# EAGLE schematic HGS_Reflector (EAGLE 9.6.1)
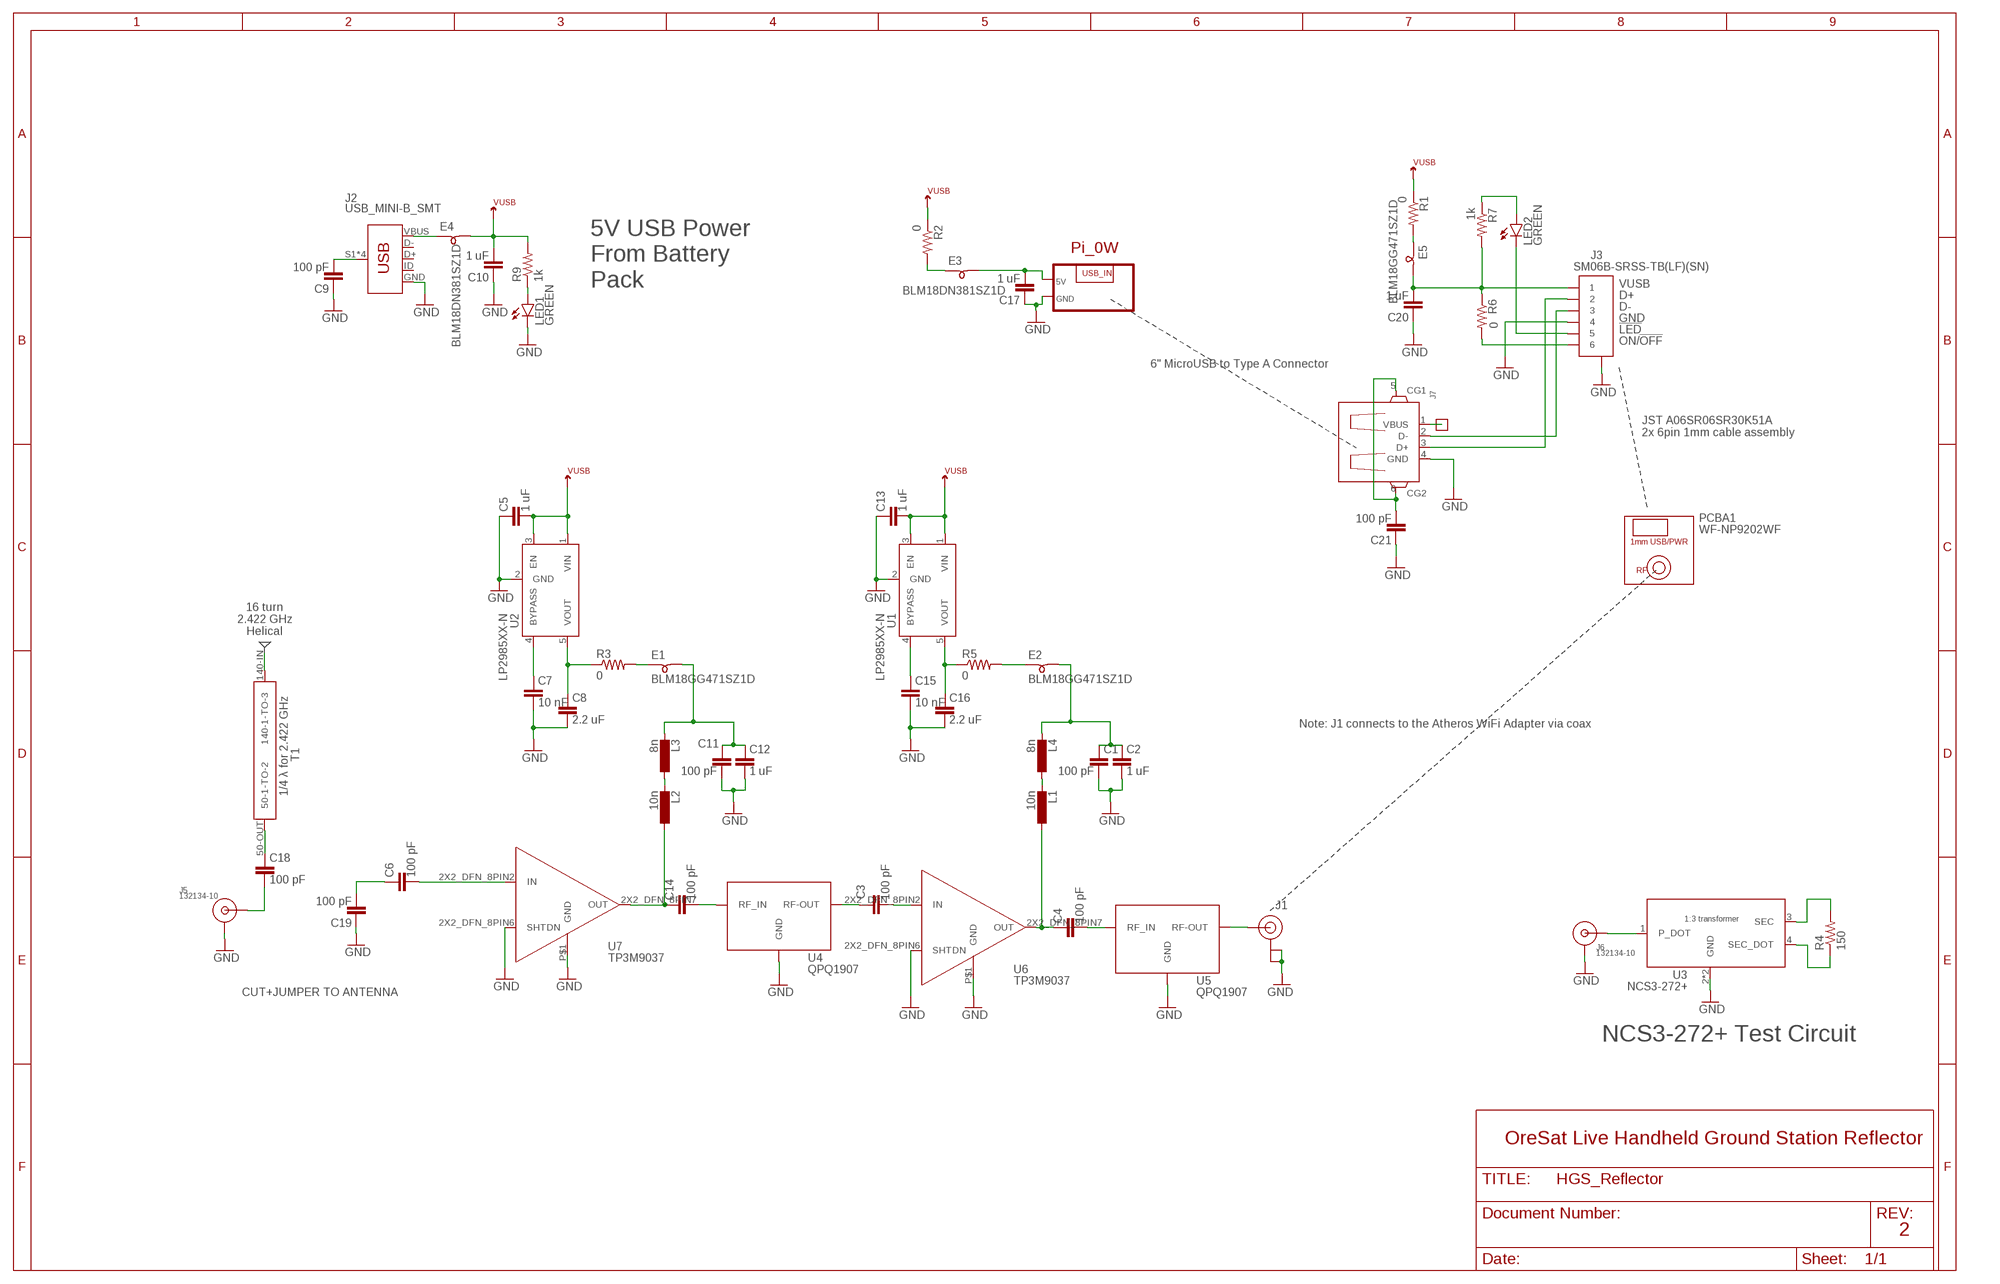
[diagram p0: schematic, sheet 1]

## Parts
C1  100 pF  C-EU0603-C-NOSILK  [.0603-C-NOSILK]
C2  1 uF  C-EU0603-C-NOSILK  [.0603-C-NOSILK]
C3  100 pF  C-EU0402-C-NOSILK  [.0402-C-NOSILK]
C4  100 pF  C-EU0402-C-NOSILK  [.0402-C-NOSILK]
C5  1 uF  C-EU0603-B-NOSILK  [.0603-B-NOSILK]
C6  100 pF  C-EU0402-C-NOSILK  [.0402-C-NOSILK]
C7  10 nF  C-EU0603-B-NOSILK  [.0603-B-NOSILK]
C8  2.2 uF  C-EU0603-B-NOSILK  [.0603-B-NOSILK]
C9  100 pF  C-EU0603-C-NOSILK  [.0603-C-NOSILK]
C10  1 uF  C-EU0603-B-NOSILK  [.0603-B-NOSILK]
C11  100 pF  C-EU0603-C-NOSILK  [.0603-C-NOSILK]
C12  1 uF  C-EU0603-C-NOSILK  [.0603-C-NOSILK]
C13  1 uF  C-EU0603-B-NOSILK  [.0603-B-NOSILK]
C14  100 pF  C-EU0402-C-NOSILK  [.0402-C-NOSILK]
C15  10 nF  C-EU0603-B-NOSILK  [.0603-B-NOSILK]
C16  2.2 uF  C-EU0603-B-NOSILK  [.0603-B-NOSILK]
C17  1 uF  C-EU0603-B-NOSILK  [.0603-B-NOSILK]
C18  100 pF  C-EU0402-C-NOSILK  [.0402-C-NOSILK]
C19  100 pF  C-EU0402-C-NOSILK  [.0402-C-NOSILK]
C20  1 uF  C-EU0603-B-NOSILK  [.0603-B-NOSILK]
C21  100 pF  C-EU0603-C-NOSILK  [.0603-C-NOSILK]
E1  BLM18GG471SZ1D  L-BEAD-0603-B  [.0603-B]
E2  BLM18GG471SZ1D  L-BEAD-0603-B  [.0603-B]
E3  BLM18DN381SZ1D  L-BEAD-0603-B  [.0603-B]
E4  BLM18DN381SZ1D  L-BEAD-0603-B  [.0603-B]
E5  BLM18GG471SZ1D  L-BEAD-0603-B  [.0603-B]
J1  U.FL  [U.FL]
J2  USB_MINI-B_SMT  [USB-MINIB]
J3  SM06B-SRSS-TB(LF)(SN)  [CONN_SM06B-SRSS-TB_JST]
J5  132134-10  [132134-10]
J6  132134-10  [132134-10]
J7  USB_HOST_W/CHASSIS_GND  [GHI2_USB_HOST_HORIZONTAL_W/CHASSIS_GND]
L1  10n  L-EUL3216C  [L3216C]
L2  10n  L-EUL3216C  [L3216C]
L3  8n  L-EUL3216C  [L3216C]
L4  8n  L-EUL3216C  [L3216C]
LED1  GREEN  LED-GREEN0603  [LED-0603]
LED2  GREEN  LED-GREEN0603  [LED-0603]
PCBA1  WF-NP9202WF  [WF-NP9202]
PCBA2  RASP_PI_0WPI_0W  [RASP_PI_0W]
R1  0  R-US_0603-B-NOSILK  [.0603-B-NOSILK]
R2  0  R-US_0603-B-NOSILK  [.0603-B-NOSILK]
R3  0  R-US_0603-B-NOSILK  [.0603-B-NOSILK]
R4  150  R-US_0402-C-NOSILK  [.0402-C-NOSILK]
R5  0  R-US_0603-B-NOSILK  [.0603-B-NOSILK]
R6  0  R-US_0603-B-NOSILK  [.0603-B-NOSILK]
R7  1k  R-US_0603-B-NOSILK  [.0603-B-NOSILK]
R9  1k  R-US_0603-B-NOSILK  [.0603-B-NOSILK]
T1  QWT2.4222  [QWT_2.422G-V2]
TP2  TEST-POINT-LARGE-SQUARE  [1X01]
U1  LP2985XX-N  [SOT-23]
U2  LP2985XX-N  [SOT-23]
U3  NCS3-272+  [GE0805C-1]
U4  QPQ1907  [QPQ1907]
U5  QPQ1907  [QPQ1907]
U6  LNA-TP3M9037  [TP3M9037]
U7  LNA-TP3M9037  [TP3M9037]

## Nets
GND: C1.2 C2.2 C5.1 C7.2 C8.2 C9.1 C10.1 C11.2 C12.2 C13.1 C15.2 C16.2 C17.1 C19.1 C20.1 C21.1 J1.1(GND) J1.2(GND) J2.GND J3.4 J3.7 J3.8 J5.SHIELD(GND) J6.SHIELD(GND) J7.4(GND) LED1.C PCBA2.GND U1.2(GND) U2.2(GND) U3.2(GND) U3.5(GND) U4.GND U4.GND2(GND) U4.GND3(GND) U5.GND U5.GND2(GND) U5.GND3(GND) U6.2X2_DFN_8PIN6(SHTDN) U6.P$1(GND) U7.2X2_DFN_8PIN6(SHTDN) U7.P$1(GND)
HELICAL: T1.140-IN(140-1-TO-3)
N$1: C7.1 U2.4(BYPASS)
N$2: E1.1 R3.2
N$3 [RF]: C4.2 U5.INPUT(RF_IN)
N$4 [RF]: C3.1 U4.OUTPUT(RF-OUT)
N$5 [RF]: J1.FEED(SIGNAL) U5.OUTPUT(RF-OUT)
N$6 [RF]: C14.2 U4.INPUT(RF_IN)
N$7: L2.2 L3.1
N$8 [RF]: C3.2 U6.2X2_DFN_8PIN2(IN)
N$9: E2.1 R5.2
N$10: LED1.A R9.1
N$11 [RF]: C6.2 U7.2X2_DFN_8PIN2(IN)
N$12: C9.2 J2.S1(SHIELD) J2.S2(SHIELD) J2.S3(SHIELD) J2.S4(SHIELD)
N$13 [RF]: C4.1 L1.1 U6.2X2_DFN_8PIN7(OUT)
N$14: L1.2 L4.1
N$15: C17.2 E3.2 PCBA2.5V
N$16 [RF]: C14.1 L2.1 U7.2X2_DFN_8PIN7(OUT)
N$17: E4.1 J2.VBUS
N$18: E3.1 R2.2
N$19: C15.1 U1.4(BYPASS)
N$20 [power]: C11.1 C12.1 E1.2 L3.2
N$21 [power]: C1.1 C2.1 E2.2 L4.2
N$22 [power]: C16.1 R5.1 U1.5(VOUT)
N$23 [RF]: C18.2 J5.CENTER(SIG)
N$24 [RF]: J6.CENTER(SIG) U3.1(P_DOT)
N$25 [power]: C8.1 R3.1 U2.5(VOUT)
N$26 [RF]: R4.2 U3.3(SEC)
N$27 [RF]: R4.1 U3.4(SEC_DOT)
N$28: C6.1 C19.2
N$29: C20.2 E5.2 J3.1 R6.1 R7.2
N$30: E5.1 R1.2
N$31: J3.6 R6.2
N$32: LED2.A R7.1
N$33: J3.2 J7.3(D+)
N$34: J3.5 LED2.C
N$36: J3.3 J7.2(D-)
N$37: J7.1(VBUS) TP2.1
N$38: C21.2 J7.5(CG1) J7.6(CG2)
T1-50 [RF]: C18.1 T1.50-OUT(50-1-TO-2)
VUSB: C5.2 C10.2 C13.2 E4.2 R1.1 R2.1 R9.2 U1.1(VIN) U1.3(EN) U2.1(VIN) U2.3(EN)
Unconnected: J2.D+ J2.D- J2.ID

## Notes on the sheet
- 5V USB Power
  From Battery
  Pack
- VUSB
- D+
- D-
- GND
- !LED
- ON/!OFF
- 6" MicroUSB to Type A Connector
- JST A06SR06SR30K51A
  2x 6pin 1mm cable assembly
- 16 turn
  2.422 GHz
  Helical
- Note: J1 connects to the Atheros WiFi Adapter via coax
- CUT+JUMPER TO ANTENNA
- NCS3-272+ Test Circuit
- OreSat Live Handheld Ground Station Reflector
- 2

## Library data of the parts
C1-C21 = oresat-rcl:C-EU: CAPACITOR, European symbol
E1-E5 = oresat-rcl:L-BEAD-*: Bead or Chip inductor ("ferrite bead") for EMI suppression
J1 = SparkFun-Connectors:U.FL: SMD Antenna Connector - U.FL 2mm height, 3.0mm x 3.0mm receptacle size. SparkFun Products: SparkFun WiFi Shield - ESP8266 <https://www.sparkfun.com/products/13287> SparkFun ESP8266 Thing <https://www.sparkfun.com/products/13231> SparkFun MiniGen - Pro Mini Signal Generator Shield <https://www.sparkfun.com/products/11420>; PROD_ID: CONN-09193; SF_ID: WRL-09144
J2 = SparkFun-Connectors:USB_MINI-B: USB type Mini-B Connector Breaks out 5th pin, and includes shield pins if needed. SparkFun Products: SparkFun FTDI Basic Breakout <https://www.sparkfun.com/products/9716> SparkFun XBee Explorer USB <https://www.sparkfun.com/products/11812> SparkFun Redboard <https://www.sparkfun.com/products/12757>; PROD_ID: CONN-08193; SF_ID: PRT-00587
J3 = J-JST-SM06B-SRSS-TB(LF)(SN)-1mm-smt-6pin:SM06B-SRSS-TB(LF)(SN); BUILT_BY: EMA_Justin; COPYRIGHT: Copyright (C) 2018 Accelerated Designs. All rights reserved; DATASHEET: http://www.jst-mfg.com/product/pdf/eng/eSR.pdf; MANUFACTURER_PART_NUMBER: SM06B-SRSS-TB(LF)(SN); SOURCELIBRARY: JST_2020-02-24; VENDOR: JST
J5 J6 = J-Amphenol-132134-10-SMA-F-SMT-vertical:132134-10
J7 = BeagleBone_Blue_R3:USB_HOST_W/CHASSIS_GND
L1 = rcl:L-EU: INDUCTOR, European symbol; IMPEDANCE: 10 nH
L2 = rcl:L-EU: INDUCTOR, European symbol; SPICEPREFIX: 10 nH
L3 L4 = rcl:L-EU: INDUCTOR, European symbol; IMPEDANCE: 8 nH
LED1 LED2 = SparkFun-LED:LED-GREEN: Green SMD LED Used in manufacturing of various products at SparkFun Packages: 0603 - SMD 0603 package [Product Link] <http://www.futureelectronics.com/en/technologies/semiconductors/optoelectronics/leds/Pages/9894312-LTST-C190GKT.aspx?CrossPart=HSMG-C190&IM=0> LilyPad 1206 - SMD1206 LilyPad package [Product Link] <http://www.futureelectronics.com/en/Technologies/Product.aspx?ProductID=IN150NGHARVATEKCORPORATION2049943&IM=0> 1206 - SMD1206 package [Product Link] <http://www.futureelectronics.com/en/technologies/semiconductors/optoelectronics/leds/Pages/8315665-LTST-C150KGKT.aspx?IM=0> 1206 Bottom Mount -SMD 1206 Bottom Mount [Product Link] <http://www.digikey.com/product-detail/en/lite-on-inc/LTST-C230KGKT/160-1456-1-ND/386854> SparkFun Products: Pro Mini 328 -5V <https://www.sparkfun.com/products/821> RedBoard <https://www.sparkfun.com/products/12757> MP3 Trigger <https://www.sparkfun.com/products/13720> Makey Makey <https://www.sparkfun.com/products/11076>; PROD_ID: DIO-00821
PCBA1 = PCBA-WF-NP9202-wifi-adapter:WF-NP9202
PCBA2 = Rasp_Pi_0W:RASP_PI_0W
R1-R7 R9 = oresat-rcl:R-US_: RESISTOR, American symbol
T1 = TM-QWT-2.422GHz:QWT2.422
TP2 = oresat-misc:TEST-POINT-LARGE-SQUARE
U1 U2 = U-TI-LP2985XX-N-linear-reg:LP2985XX-N: TI 150mA Low Noise LDO Regulators LP2985-N (various fixed >2.0V) Source: Datasheet <http://www.ti.com/product/LP2985-N?qgpn=lp2985-n> LP2985LV-N (1.5, 1.8, 2.0V fixed) Source: Datasheet <http://www.ti.com/product/LP2985LV-N?qgpn=lp2985lv-n>
U3 = U-MiniCirc-NCS3-272+-1-to-3-transformer:NCS3-272+
U4 U5 = U-Qorvo-QPQ1907-2.4GHz-BAW-BPF:QPQ1907
U6 U7 = TP3M9037_LNA:LNA-TP3M9037

## Net classes
2 RF: clearance 0.75 mm